# Altium schematic sheet DAB.SchDoc
size A2
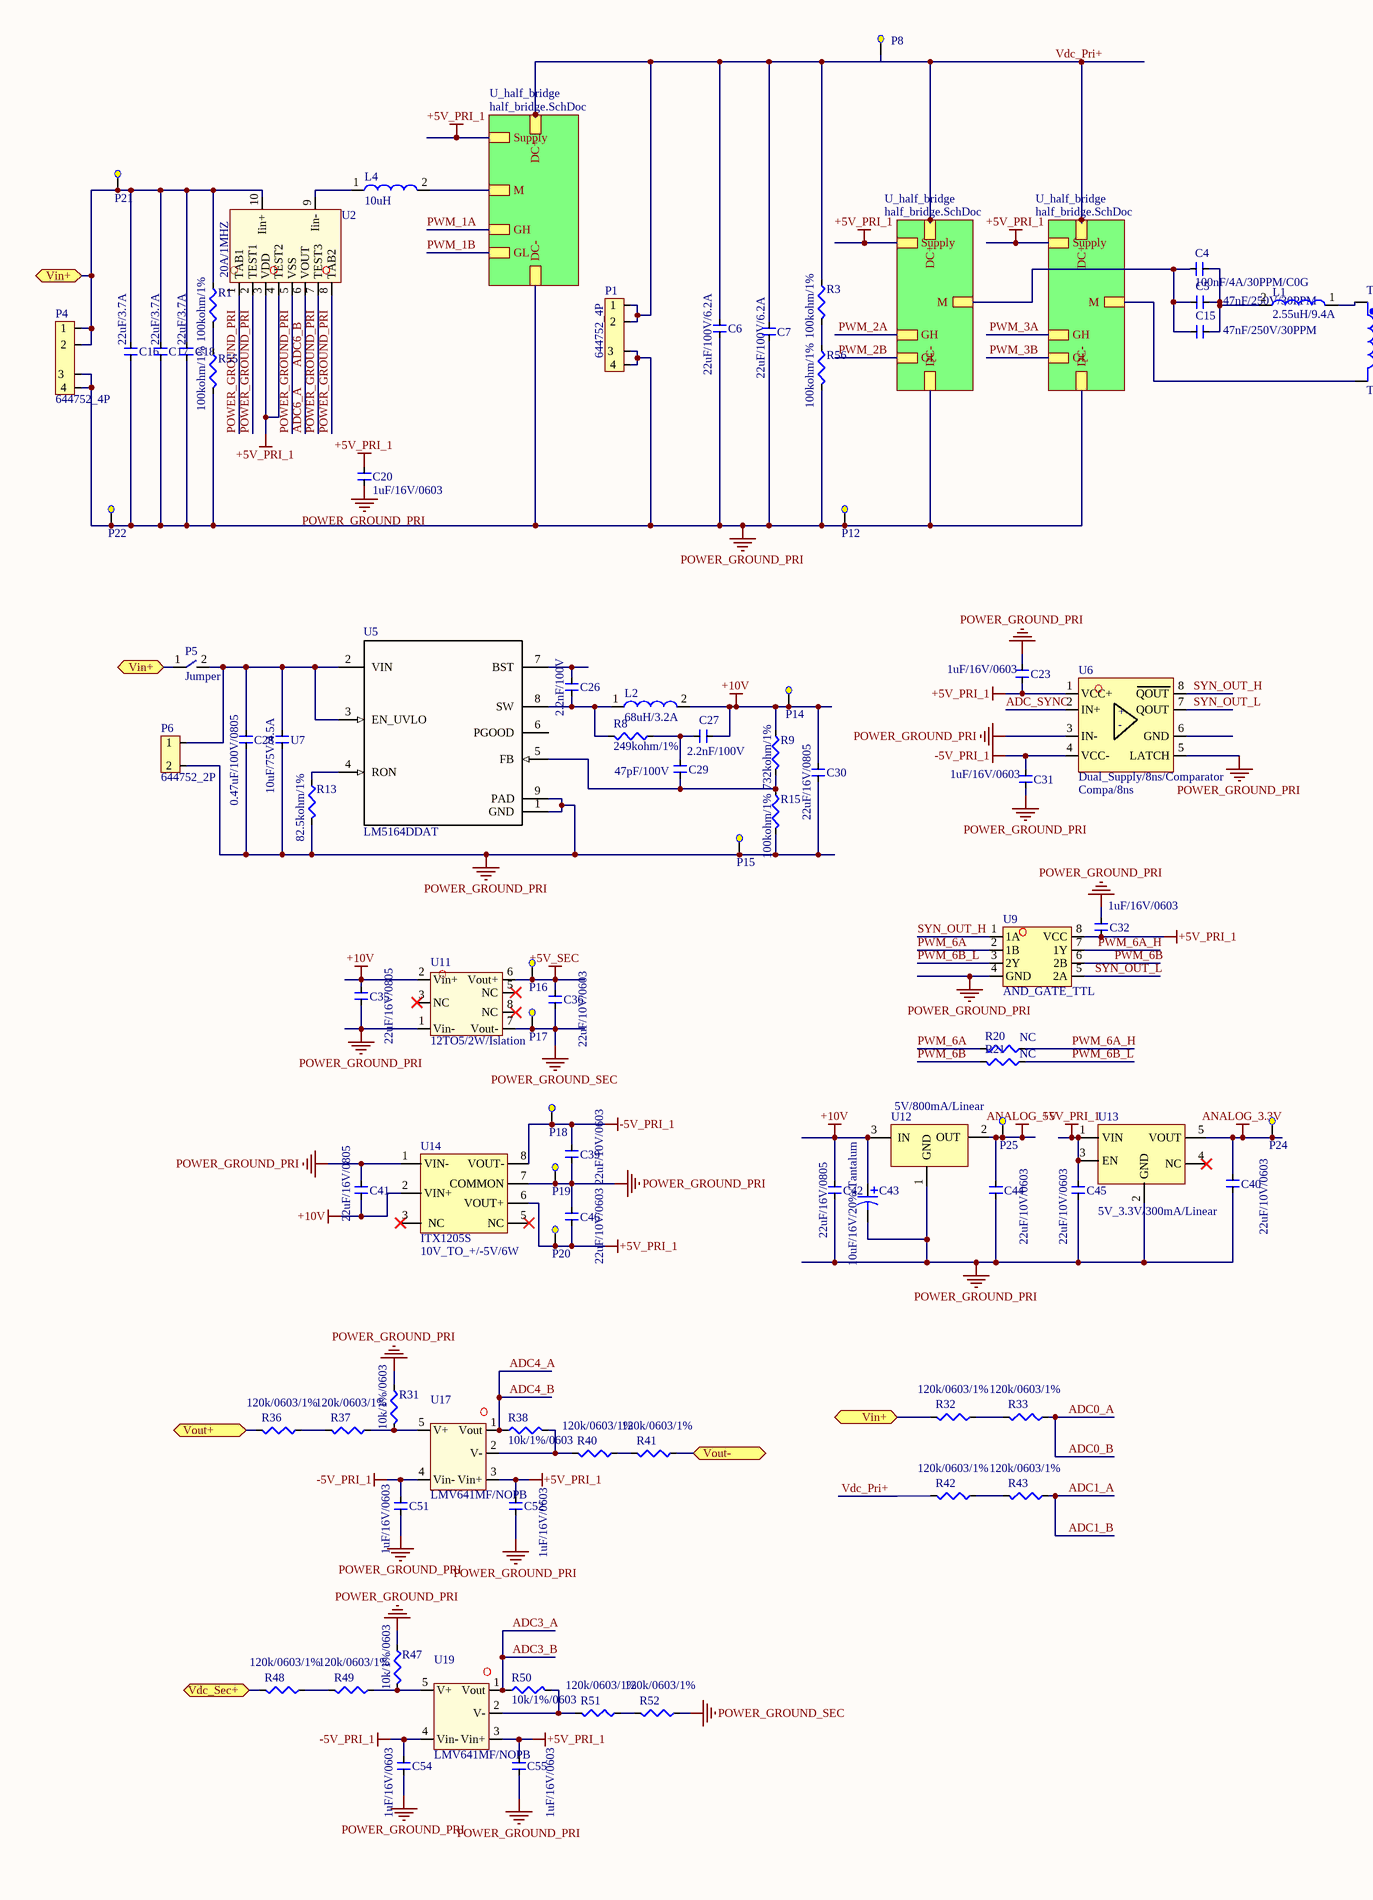
[diagram p0: DAB.SchDoc, left]
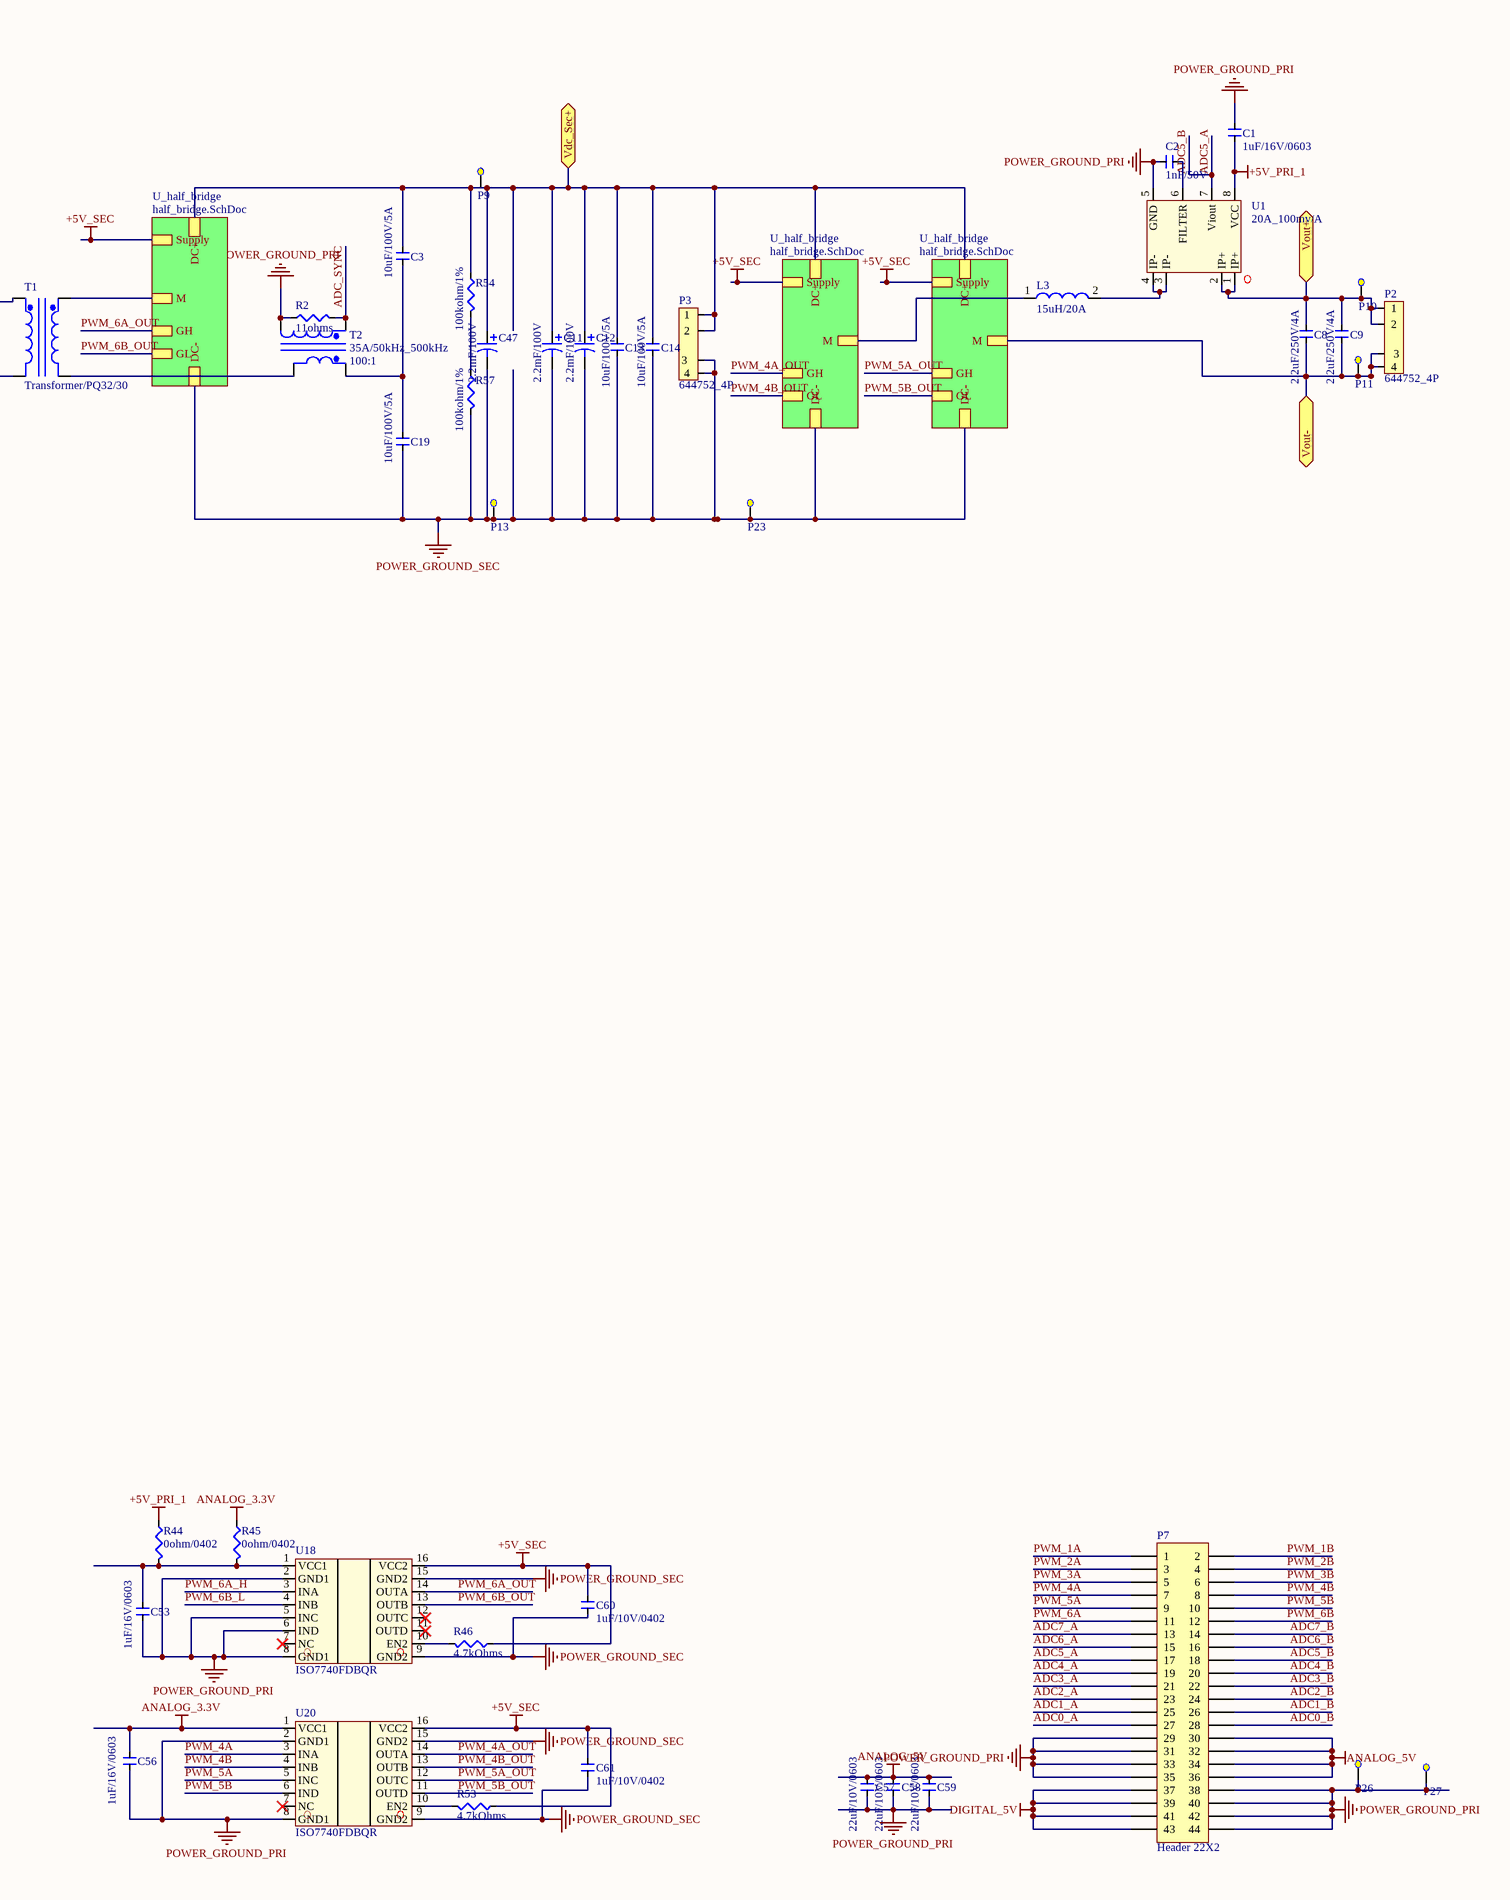
[diagram p1: DAB.SchDoc, right]

## Parts
C1  1uF/16V/20%/0603/X7R  [C0603]  (value not drawn)
C2  1nF/50V/10%/X7R  [C0603]  (value not drawn)
C3  10uF/100V/2220/5A/10%  [C2220]  (value not drawn)
C4  100nF/250V/4A/1812/30PPM/5%  [C1812]  (value not drawn)
C5  47nF/5%/250V/5.1Aac/30PPM/1210  [C1210]  (value not drawn)
C6  22uF/100V/6.2A/2220/X7S/20%  [C2220]  (value not drawn)
C7  22uF/100V/6.2A/2220/X7S/20%  [C2220]  (value not drawn)
C8  2.2uF/250V/4A/2220/X7T/10%  [C2220]  (value not drawn)
C9  2.2uF/250V/4A/2220/X7T/10%  [C2220]  (value not drawn)
C11  2.2mF/100V/22mm  [VSN_P22]  (value not drawn)
C12  2.2mF/100V/22mm  [VSN_P22]  (value not drawn)
C13  10uF/100V/2220/5A/10%  [C2220]  (value not drawn)
C14  10uF/100V/2220/5A/10%  [C2220]  (value not drawn)
C15  47nF/5%/250V/5.1Aac/30PPM/1210  [C1210]  (value not drawn)
C16  22uF/100V/3.7A/2220/X7S/5%  [C2220]  (value not drawn)
C17  22uF/100V/3.7A/2220/X7S/5%  [C2220]  (value not drawn)
C18  22uF/100V/3.7A/2220/X7S/5%  [C2220]  (value not drawn)
C19  10uF/100V/2220/5A/10%  [C2220]  (value not drawn)
C20  1uF/16V/20%/0603/X7R  [C0603]  (value not drawn)
C23  1uF/16V/20%/0603/X7R  [C0603]  (value not drawn)
C26  2.2nF/100V/0603/X7R/10%  [C0603]  (value not drawn)
C27  2.2nF/100V/0603/X7R/10%  [C0603]  (value not drawn)
C28  0.47uF/100V/10%/0805/X7R  [C0805]  (value not drawn)
C29  47pF/100V/0603/C0G/5%  [C0603]  (value not drawn)
C30  22uF/16V/20%/0805/X5R  [C0805]  (value not drawn)
C31  1uF/16V/20%/0603/X7R  [C0603]  (value not drawn)
C32  1uF/16V/20%/0603/X7R  [C0603]  (value not drawn)
C35  22uF/16V/20%/0805/X5R  [C0805]  (value not drawn)
C36  22uF/10V/20%/0603/X5R  [C0603]  (value not drawn)
C39  22uF/10V/20%/0603/X5R  [C0603]  (value not drawn)
C40  22uF/10V/20%/0603/X5R  [C0603]  (value not drawn)
C41  22uF/16V/20%/0805/X5R  [C0805]  (value not drawn)
C42  22uF/16V/20%/0805/X5R  [C0805]  (value not drawn)
C43  10uF/16V/20%/Tantalum  [1206 _C]
C44  22uF/10V/20%/0603/X5R  [C0603]  (value not drawn)
C45  22uF/10V/20%/0603/X5R  [C0603]  (value not drawn)
C46  22uF/10V/20%/0603/X5R  [C0603]  (value not drawn)
C47  2.2mF/100V/22mm  [VSN_P22]  (value not drawn)
C51  1uF/16V/20%/0603/X7R  [C0603]  (value not drawn)
C52  1uF/16V/20%/0603/X7R  [C0603]  (value not drawn)
C53  1uF/16V/20%/0603/X7R  [C0603]  (value not drawn)
C54  1uF/16V/20%/0603/X7R  [C0603]  (value not drawn)
C55  1uF/16V/20%/0603/X7R  [C0603]  (value not drawn)
C56  1uF/16V/20%/0603/X7R  [C0603]  (value not drawn)
C57  22uF/10V/20%/0603/X5R  [C0603]  (value not drawn)
C58  22uF/10V/20%/0603/X5R  [C0603]  (value not drawn)
C59  22uF/10V/20%/0603/X5R  [C0603]  (value not drawn)
C60  1uF/10V/0402/X5R/10%  [C0402]  (value not drawn)
C61  1uF/10V/0402/X5R/10%  [C0402]  (value not drawn)
L1  2.55uH/9.4A  [PQ26/20]
L2  68uH/3.2A  [68uH/3.2A]
L3  VER2923-153  [VER2923-153KL]  (value not drawn)
L4  PCV-0-103-20L  [PCV-0-103-20L]  (value not drawn)
P1  644752_4/3.96mm  [644752-4P]  (value not drawn)
P2  644752_4/3.96mm  [644752-4P]  (value not drawn)
P3  644752_4/3.96mm  [644752-4P]  (value not drawn)
P4  644752_4/3.96mm  [644752-4P]  (value not drawn)
P5  Jumper/2.54  [2P_2.54mm]  (value not drawn)
P6  644752_2/3.96mm  [644752_2P]  (value not drawn)
P7  Header 22X2  [HDR2X22]
P8  Test_Point_0.5mm  [Test_Point-0.5mm]  (value not drawn)
P9  Test_Point_0.5mm  [Test_Point-0.5mm]  (value not drawn)
P10  Test_Point_0.5mm  [Test_Point-0.5mm]  (value not drawn)
P11  Test_Point_0.5mm  [Test_Point-0.5mm]  (value not drawn)
P12  Test_Point_0.5mm  [Test_Point-0.5mm]  (value not drawn)
P13  Test_Point_0.5mm  [Test_Point-0.5mm]  (value not drawn)
P14  Test_Point_0.5mm  [Test_Point-0.5mm]  (value not drawn)
P15  Test_Point_0.5mm  [Test_Point-0.5mm]  (value not drawn)
P16  Test_Point_0.5mm  [Test_Point-0.5mm]  (value not drawn)
P17  Test_Point_0.5mm  [Test_Point-0.5mm]  (value not drawn)
P18  Test_Point_0.5mm  [Test_Point-0.5mm]  (value not drawn)
P19  Test_Point_0.5mm  [Test_Point-0.5mm]  (value not drawn)
P20  Test_Point_0.5mm  [Test_Point-0.5mm]  (value not drawn)
P21  Test_Point_0.5mm  [Test_Point-0.5mm]  (value not drawn)
P22  Test_Point_0.5mm  [Test_Point-0.5mm]  (value not drawn)
P23  Test_Point_0.5mm  [Test_Point-0.5mm]  (value not drawn)
P24  Test_Point_0.5mm  [Test_Point-0.5mm]  (value not drawn)
P25  Test_Point_0.5mm  [Test_Point-0.5mm]  (value not drawn)
P26  Test_Point_0.5mm  [Test_Point-0.5mm]  (value not drawn)
P27  Test_Point_0.5mm  [Test_Point-0.5mm]  (value not drawn)
R1  100kohm/0603/0.1W/1%  [R0603]  (value not drawn)
R2  11ohms/0805/0.5%/0.125  [R0805]  (value not drawn)
R3  100kohm/0603/0.1W/1%  [R0603]  (value not drawn)
R8  249kohm/0603/0.1W/1%  [R0603]  (value not drawn)
R9  732kohm/0603/0.1W/1%  [R0603]  (value not drawn)
R13  82.5kohm/0603/0.1W/1%  [R0603]  (value not drawn)
R15  100kohm/0603/0.1W/1%  [R0603]  (value not drawn)
R20  0ohm/0603/0.1W  [R0603]  (value not drawn)
R21  0ohm/0603/0.1W  [R0603]  (value not drawn)
R31  10k/0603/0.125W/1%  [R0603]  (value not drawn)
R32  120kohm/1%/0.1w/0603  [R0603]  (value not drawn)
R33  120kohm/1%/0.1w/0603  [R0603]  (value not drawn)
R36  120kohm/1%/0.1w/0603  [R0603]  (value not drawn)
R37  120kohm/1%/0.1w/0603  [R0603]  (value not drawn)
R38  10k/0603/0.125W/1%  [R0603]  (value not drawn)
R40  120kohm/1%/0.1w/0603  [R0603]  (value not drawn)
R41  120kohm/1%/0.1w/0603  [R0603]  (value not drawn)
R42  120kohm/1%/0.1w/0603  [R0603]  (value not drawn)
R43  120kohm/1%/0.1w/0603  [R0603]  (value not drawn)
R44  0ohm/0402/0.063W  [R0402]  (value not drawn)
R45  0ohm/0402/0.063W  [R0402]  (value not drawn)
R46  4.7kOhms/0.1w/5%/0603  [R0603]  (value not drawn)
R47  10k/0603/0.125W/1%  [R0603]  (value not drawn)
R48  120kohm/1%/0.1w/0603  [R0603]  (value not drawn)
R49  120kohm/1%/0.1w/0603  [R0603]  (value not drawn)
R50  10k/0603/0.125W/1%  [R0603]  (value not drawn)
R51  120kohm/1%/0.1w/0603  [R0603]  (value not drawn)
R52  120kohm/1%/0.1w/0603  [R0603]  (value not drawn)
R53  4.7kOhms/0.1w/5%/0603  [R0603]  (value not drawn)
R54  100kohm/0603/0.1W/1%  [R0603]  (value not drawn)
R55  100kohm/0603/0.1W/1%  [R0603]  (value not drawn)
R56  100kohm/0603/0.1W/1%  [R0603]  (value not drawn)
R57  100kohm/0603/0.1W/1%  [R0603]  (value not drawn)
T1  Transformer/PQ32/30  [PQ32/30]
T2  35A/50kHz_500kHz  [673-PB0026NLT]
U1  +-20A_100mv/A/0.8%/120kHz  [SOIC8]  (value not drawn)
U2  20A/200mv_A/0.5%/Unidirection/5Vcc/1MHz  [CQ330E]  (value not drawn)
U5  LM5164DDAT  [DDA0008E_N]
U6  Dual_Supply/8ns/Comparator  [MSOP8]
U7  10uF/75V/10%/X7R/4.5A  [C1210]  (value not drawn)
U9  74HCT2G08DP  [MSOP8]  (value not drawn)
U11  12TO5/2W/Islation  [SPAN02A-05]
U12  5V/800mA/Linear  [SOT-223]
U13  5V_3.3V/300mA/Linear  [SOT23-5]
U14  ITX1205S
U17  LMV641MF/NOPB  [SOT-23-5]
U18  ISO7740FDBQR  [DBQ0016A]
U19  LMV641MF/NOPB  [SOT-23-5]
U20  ISO7740FDBQR  [DBQ0016A]

## Sub-sheets
U_half_bridge = half_bridge.SchDoc: M, GH, GL, Supply, DC-, DC+
U_half_bridge = half_bridge.SchDoc: M, GH, GL, Supply, DC-, DC+
U_half_bridge = half_bridge.SchDoc: M, GH, GL, Supply, DC-, DC+
U_half_bridge = half_bridge.SchDoc: M, GH, GL, Supply, DC-, DC+
U_half_bridge = half_bridge.SchDoc: M, GH, GL, Supply, DC-, DC+
U_half_bridge = half_bridge.SchDoc: M, GH, GL, Supply, DC-, DC+

## Ports
Vdc_Sec+, Vin+, Vout+, Vout-

## Nets
+5V_PRI_1: C1.2 C20.2 C23.1 C32.1 C45.2 C46.1 C52.2 C55.2 P20.1(Pri1+) R44.2 U1.8(VCC) U2.3(VDD) U2.4(TEST2) U6.1(VCC+) U9.8(VCC) U13.1(VIN) U13.3(EN) U14.6(VOUT+) U17.3(Vin+) U19.3(Vin+) ; sheet U_half_bridge/Supply, sheet U_half_bridge/Supply, sheet U_half_bridge/Supply
+5V_SEC: C36.2 C60.2 C61.2 P16.1(Pri1+) R46.2 R53.2 U11.6(Vout+) U18.16(VCC2) U20.16(VCC2) ; sheet U_half_bridge/Supply, sheet U_half_bridge/Supply, sheet U_half_bridge/Supply
+10V: C27.2 C30.2 C35.2 C41.1 C42.2 C43.1 L2.2 P14.1(Pri1+) R9.2 U11.2(Vin+) U12.3(IN) U14.2(VIN+)
-5V_PRI_1: C31.2 C39.2 C51.2 C54.2 P18.1(Pri1+) U6.4(VCC-) U14.8(VOUT-) U17.4(Vin-) U19.4(Vin-)
ANALOG_3.3V: C40.2 C56.2 P24.1(Pri1+) R45.2 U13.5(VOUT) U20.1(VCC1)
ANALOG_5V: C44.2 C57.2 C58.2 C59.2 P7.30 P7.32 P7.34 P7.36 P25.1(Pri1+) U12.2(OUT)
DIGITAL_5V: P7.37 P7.39 P7.41 P7.43
POWER_GROUND_PRI: C1.1 C2.2 C6.1 C7.1 C16.1 C17.1 C18.1 C20.1 C23.2 C28.1 C30.1 C31.1 C32.2 C35.1 C39.1 C40.1 C41.2 C42.1 C43.2 C44.1 C45.1 C46.2 C51.1 C52.1 C53.1 C54.1 C55.1 C56.1 C57.1 C58.1 C59.1 P1.3 P1.4 P4.3 P4.4 P6.2 P7.29 P7.31 P7.33 P7.35 P7.38 P7.40 P7.42 P7.44 P12.1(Pri1+) P15.1(Pri1+) P19.1(Pri1+) P22.1(Pri1+) P26.1(Pri1+) P27.1(Pri1+) R2.1 R13.1 R15.1 R31.2 R47.2 R55.1 R56.1 T2.4(Sec1-) U1.5(GND) U2.1(TAB1) U2.2(TEST1) U2.5(VSS) U2.7(TEST3) U2.8(TAB2) U5.1(GND) U5.9(PAD) U6.3(IN-) U6.5(LATCH) U7.1 U9.4(GND) U11.1(Vin-) U12.1(GND) U13.2(GND) U14.1(VIN-) U14.7(COMMON) U18.2(GND1) U18.5(INC) U18.6(IND) U18.8(GND1) U20.2(GND1) U20.8(GND1) ; sheet U_half_bridge/DC-, sheet U_half_bridge/DC-, sheet U_half_bridge/DC-
POWER_GROUND_SEC: C11.2 C12.2 C13.1 C14.1 C19.1 C36.1 C47.2 C60.1 C61.1 P3.3 P3.4 P13.1(Pri1+) P17.1(Pri1+) P23.1(Pri1+) R52.2 R57.1 U11.7(Vout-) U18.9(GND2) U18.15(GND2) U20.9(GND2) U20.15(GND2) ; sheet U_half_bridge/DC-, sheet U_half_bridge/DC-, sheet U_half_bridge/DC-
ADC0_A: P7.27 P7.28 R33.2  [also labelled ADC0_B]
ADC1_A: P7.25 P7.26 R43.2  [also labelled ADC1_B]
ADC2_A: P7.23
ADC2_B: P7.24
ADC3_A: P7.21 P7.22 R50.2 U19.1(Vout)  [also labelled ADC3_B]
ADC4_A: P7.19 P7.20 R38.2 U17.1(Vout)  [also labelled ADC4_B]
ADC5_A: P7.17 P7.18 U1.7(Viout)  [also labelled ADC5_B]
ADC6_A: P7.15 P7.16 U2.6(VOUT)  [also labelled ADC6_B]
ADC7_A: P7.13
ADC7_B: P7.14
ADC_SYNC: R2.2 T2.2(Sec1+) U6.2(IN+)
PWM_1A: P7.1 ; sheet U_half_bridge/GH
PWM_1B: P7.2 ; sheet U_half_bridge/GL
PWM_2A: P7.3 ; sheet U_half_bridge/GH
PWM_2B: P7.4 ; sheet U_half_bridge/GL
PWM_3A: P7.5 ; sheet U_half_bridge/GH
PWM_3B: P7.6 ; sheet U_half_bridge/GL
PWM_4A: P7.7 U20.3(INA)
PWM_4A_OUT: U20.14(OUTA) ; sheet U_half_bridge/GH
PWM_4B: P7.8 U20.4(INB)
PWM_4B_OUT: U20.13(OUTB) ; sheet U_half_bridge/GL
PWM_5A: P7.9 U20.5(INC)
PWM_5A_OUT: U20.12(OUTC) ; sheet U_half_bridge/GH
PWM_5B: P7.10 U20.6(IND)
PWM_5B_OUT: U20.11(OUTD) ; sheet U_half_bridge/GL
PWM_6A: P7.11 R20.1 U9.2(1B)
PWM_6A_H: R20.2 U9.7(1Y) U18.3(INA)
PWM_6A_OUT: U18.14(OUTA) ; sheet U_half_bridge/GH
PWM_6B: P7.12 R21.1 U9.6(2B)
PWM_6B_L: R21.2 U9.3(2Y) U18.4(INB)
PWM_6B_OUT: U18.13(OUTB) ; sheet U_half_bridge/GL
SYN_OUT_H: U6.8(QOUT) U9.1(1A)
SYN_OUT_L: U6.7(QOUT) U9.5(2A)
Vdc_Pri+: C6.2 C7.2 P1.1 P1.2 P8.1(Pri1+) R3.2 R42.1 ; sheet U_half_bridge/DC+, sheet U_half_bridge/DC+, sheet U_half_bridge/DC+
Vdc_Sec+: C3.2 C11.1 C12.1 C13.2 C14.2 C47.1 P3.1 P3.2 P9.1(Pri1+) R48.1 R54.2 ; port Vdc_Sec+, sheet U_half_bridge/DC+, sheet U_half_bridge/DC+, sheet U_half_bridge/DC+
Vin+: C16.2 C17.2 C18.2 P4.1 P4.2 P5.1 P21.1(Pri1+) R1.2 R32.1 U2.10(Iin+) ; port Vin+
Vout+: C8.2 C9.2 P2.1 P2.2 P10.1(Pri1+) R36.1 U1.1(IP+) U1.2(IP+) ; port Vout+
Vout-: C8.1 C9.1 P2.3 P2.4 P11.1(Pri1+) R41.2 ; port Vout-, sheet U_half_bridge/M
NetC2_1: C2.1 U1.6(FILTER)
NetC3_1: C3.1 C19.2 T2.11(Pri1+)
NetC4_1: C4.1 C5.1 C15.1 ; sheet U_half_bridge/M
NetC4_2: C4.2 C5.2 C15.2 L1.2
NetC26_1: C26.1 U5.7(BST)
NetC26_2: C26.2 L2.1 R8.1 U5.8(SW)
NetC27_1: C27.1 C29.1 R8.2
NetC28_2: C28.2 P5.2 P6.1 U5.2(VIN) U5.3(EN_UVLO) U7.2
NetC29_2: C29.2 R9.1 R15.2 U5.5(FB)
NetC53_2: C53.2 R44.1 R45.1 U18.1(VCC1)
NetL1_1: L1.1 T1.1(Pri1+)
NetL3_1: L3.1 ; sheet U_half_bridge/M
NetL3_2: L3.2 U1.3(IP-) U1.4(IP-)
NetL4_1: L4.1 U2.9(Iin-)
NetL4_2: L4.2 ; sheet U_half_bridge/M
NetR1_1: R1.1 R55.2
NetR3_1: R3.1 R56.2
NetR13_2: R13.2 U5.4(RON)
NetR31_1: R31.1 R37.2 U17.5(V+)
NetR32_2: R32.2 R33.1
NetR36_2: R36.2 R37.1
NetR38_1: R38.1 R40.1 U17.2(V-)
NetR40_2: R40.2 R41.1
NetR42_2: R42.2 R43.1
NetR46_1: R46.1 U18.10(EN2)
NetR47_1: R47.1 R49.2 U19.5(V+)
NetR48_2: R48.2 R49.1
NetR50_1: R50.1 R51.1 U19.2(V-)
NetR51_2: R51.2 R52.1
NetR53_1: R53.1 U20.10(EN2)
NetR54_1: R54.1 R57.2
NetT1_2: T1.2(Pri1-) ; sheet U_half_bridge/M
NetT1_3: T1.3(Sec1-) ; sheet U_half_bridge/M
NetT1_4: T1.4(Sec1+) T2.12(Pri1-)

Not connected (* = marked no-connect by the designer): U5 6(PGOOD); U6 6(GND); U11 3(NC)* 5(NC)* 8(NC)*; U13 4(NC)*; U14 3(NC)* 5(NC)*; U18 7(NC)* 11(OUTD)* 12(OUTC)*; U20 7(NC)*

## Notes on the sheet
- Title
- Size:
- Date:
- File:
- A2
- Number:
- Time:
- Revision:
- Sheet
- of
- (in symbol 0.47uF/100V/10%/0805/X7R) 0.47uF/100V/0805
- (in symbol 0ohm/0402/0.063W) 0ohm/0402
- (in symbol 0ohm/0603/0.1W) NC
- (in symbol 1nF/50V/10%/X7R) 1nF/50V
- (in symbol 1uF/10V/0402/X5R/10%) 1uF/10V/0402
- (in symbol 1uF/16V/20%/0603/X7R) 1uF/16V/0603
- (in symbol 2.2mF/100V/22mm) 2.2mF/100V
- (in symbol 2.2nF/100V/0603/X7R/10%) 2.2nF/100V
- (in symbol 2.2uF/250V/4A/2220/X7T/10%) 2.2uF/250V/4A
- (in symbol 4.7kOhms/0.1w/5%/0603) 4.7kOhms
- (in symbol 10k/0603/0.125W/1%) 10k/1%/0603
- (in symbol 10uF/75V/10%/X7R/4.5A) 10uF/75V/4.5A
- (in symbol 10uF/100V/2220/5A/10%) 10uF/100V/5A
- (in symbol 11ohms/0805/0.5%/0.125) 11ohms
- (in symbol 20A/200mv_A/0.5%/Unidirection/5Vcc/1MHz) 20A/1MHZ
- (in symbol 22uF/10V/20%/0603/X5R) 22uF/10V/0603
- (in symbol 22uF/16V/20%/0805/X5R) 22uF/16V/0805
- (in symbol 22uF/100V/3.7A/2220/X7S/5%) 22uF/3.7A
- (in symbol 22uF/100V/6.2A/2220/X7S/20%) 22uF/100V/6.2A
- (in symbol 35A/50kHz_500kHz) 100:1
- (in symbol 47nF/5%/250V/5.1Aac/30PPM/1210) 47nF/250V/30PPM
- (in symbol 47pF/100V/0603/C0G/5%) 47pF/100V
- (in symbol 74HCT2G08DP) AND_GATE_TTL
- (in symbol 82.5kohm/0603/0.1W/1%) 82.5kohm/1%
- (in symbol 100kohm/0603/0.1W/1%) 100kohm/1%
- (in symbol 100nF/250V/4A/1812/30PPM/5%) 100nF/4A/30PPM/C0G
- (in symbol 120kohm/1%/0.1w/0603) 120k/0603/1%
- (in symbol 249kohm/0603/0.1W/1%) 249kohm/1%
- (in symbol 732kohm/0603/0.1W/1%) 732kohm/1%
- (in symbol 644752_2/3.96mm) 644752_2P
- (in symbol 644752_4/3.96mm) 644752_4P
- (in symbol +-20A_100mv/A/0.8%/120kHz) 20A_100mv/A
- (in symbol Dual_Supply/8ns/Comparator) +; -; Compa/8ns
- (in symbol ITX1205S) 10V_TO_+/-5V/6W
- (in symbol Jumper/2.54) Jumper
- (in symbol PCV-0-103-20L) 10uH
- (in symbol VER2923-153) 15uH/20A

## Library data of the parts
C1 C20 C23 C31 C32 C51-C56 = 1uF/16V/20%/0603/X7R: 1276-6524-1-ND
C2 = 1nF/50V/10%/X7R: 311-1080-1-ND
C3 C13 C14 C19 = 10uF/100V/2220/5A/10%: C5750X7S2A106K230KB
C4 = 100nF/250V/4A/1812/30PPM/5%: 445-15480-1-ND
C5 C15 = 47nF/5%/250V/5.1Aac/30PPM/1210: 445-15461-1-ND
C6 C7 = 22uF/100V/6.2A/2220/X7S/20%: 445-C5750X7S2A226M280KBCT-ND
C8 C9 = 2.2uF/250V/4A/2220/X7T/10%: 445-7775-1-ND
C11 C12 C47 = 2.2mF/100V/22mm: 565-2707-ND
C16-C18 = 22uF/100V/3.7A/2220/X7S/5%: CKG57NX7S2A226M500JH
C26 C27 = 2.2nF/100V/0603/X7R/10%: 399-7880-1-ND
C28 = 0.47uF/100V/10%/0805/X7R: 490-3326-1-ND
C29 = 47pF/100V/0603/C0G/5%: 399-16021-1-ND
C30 C35 C41 C42 = 22uF/16V/20%/0805/X5R: 490-9952-1-ND
C36 C39 C40 C44-C46 C57-C59 = 22uF/10V/20%/0603/X5R: 1276-6504-1-ND
C43 = 10uF/16V/20%/Tantalum: 478-3451-1-ND
C60 C61 = 1uF/10V/0402/X5R/10%: 311-1439-1-ND
L1 = 2.55uH/9.4A: 445-180846-ND/495-75904-ND
L2 = 68uH/3.2A: 732-1247-1-ND
L3 = VER2923-153: VER2923-153KL
P1-P4 = 644752_4/3.96mm: A24166-ND
P6 = 644752_2/3.96mm: A24164-ND
P7 = Header 22X2: Header, 22-Pin, Dual row; LatestRevisionDate: 17-Jul-2002; LatestRevisionNote: Re-released for DXP Platform.; Publisher: Altium Limited
R1 R3 R15 R54-R57 = 100kohm/0603/0.1W/1%: 541-100KHCT-ND
R2 = 11ohms/0805/0.5%/0.125: P123887CT-ND
R8 = 249kohm/0603/0.1W/1%: 541-249KHCT-ND
R9 = 732kohm/0603/0.1W/1%: 311-732KHRCT-ND
R13 = 82.5kohm/0603/0.1W/1%: 541-82.5KHCT-ND
R20 R21 = 0ohm/0603/0.1W: P0.0GCT-ND
R31 R38 R47 R50 = 10k/0603/0.125W/1%: RNCP0603FTD10K0CT-ND
R32 R33 R36 R37 R40-R43 R48 R49 R51 R52 = 120kohm/1%/0.1w/0603: YAG3352CT-ND
R44 R45 = 0ohm/0402/0.063W: 311-0.0JRCT-ND
R46 R53 = 4.7kOhms/0.1w/5%/0603: 311-4.7KGRCT-ND
T1 = Transformer/PQ32/30: 445-180849-ND;;495-5330-ND
T2 = 35A/50kHz_500kHz: 673-PB0026NLT
U1 = +-20A_100mv/A/0.8%/120kHz: ACS724LLCTR-20AB-T
U2 = 20A/200mv_A/0.5%/Unidirection/5Vcc/1MHz: 974-1138-1-ND
U5 = LM5164DDAT: 296-53428-1-ND; Manufacturer: Texas Instruments; PartNumber: LM5164DDAT; RefDes: RefDes; Type: DEV; Value: Value; Copyright: Copyright (C) 2018 Accelerated Designs. All rights reserved
U6 = Dual_Supply/8ns/Comparator: LT1713CMS8#TRPBFCT-ND
U7 = 10uF/75V/10%/X7R/4.5A: 445-C3225X7R1N106K250ACCT-ND
U9 = 74HCT2G08DP: 1727-5969-2-ND
U11 = 12TO5/2W/Islation: 1866-4765-ND
U12 = 5V/800mA/Linear: LM1117MPX-5.0/NOPBCT-ND
U13 = 5V_3.3V/300mA/Linear: 576-4764-1-ND
U14 = ITX1205S: 1470-2533-5-ND
U17 U19 = LMV641MF/NOPB: 296-48929-1-ND
U18 U20 = ISO7740FDBQR: 296-48139-1-ND